# Altium schematic sheet BARTGL.SchDoc
size A3; SheetNumber: 22; SheetTotal: 22
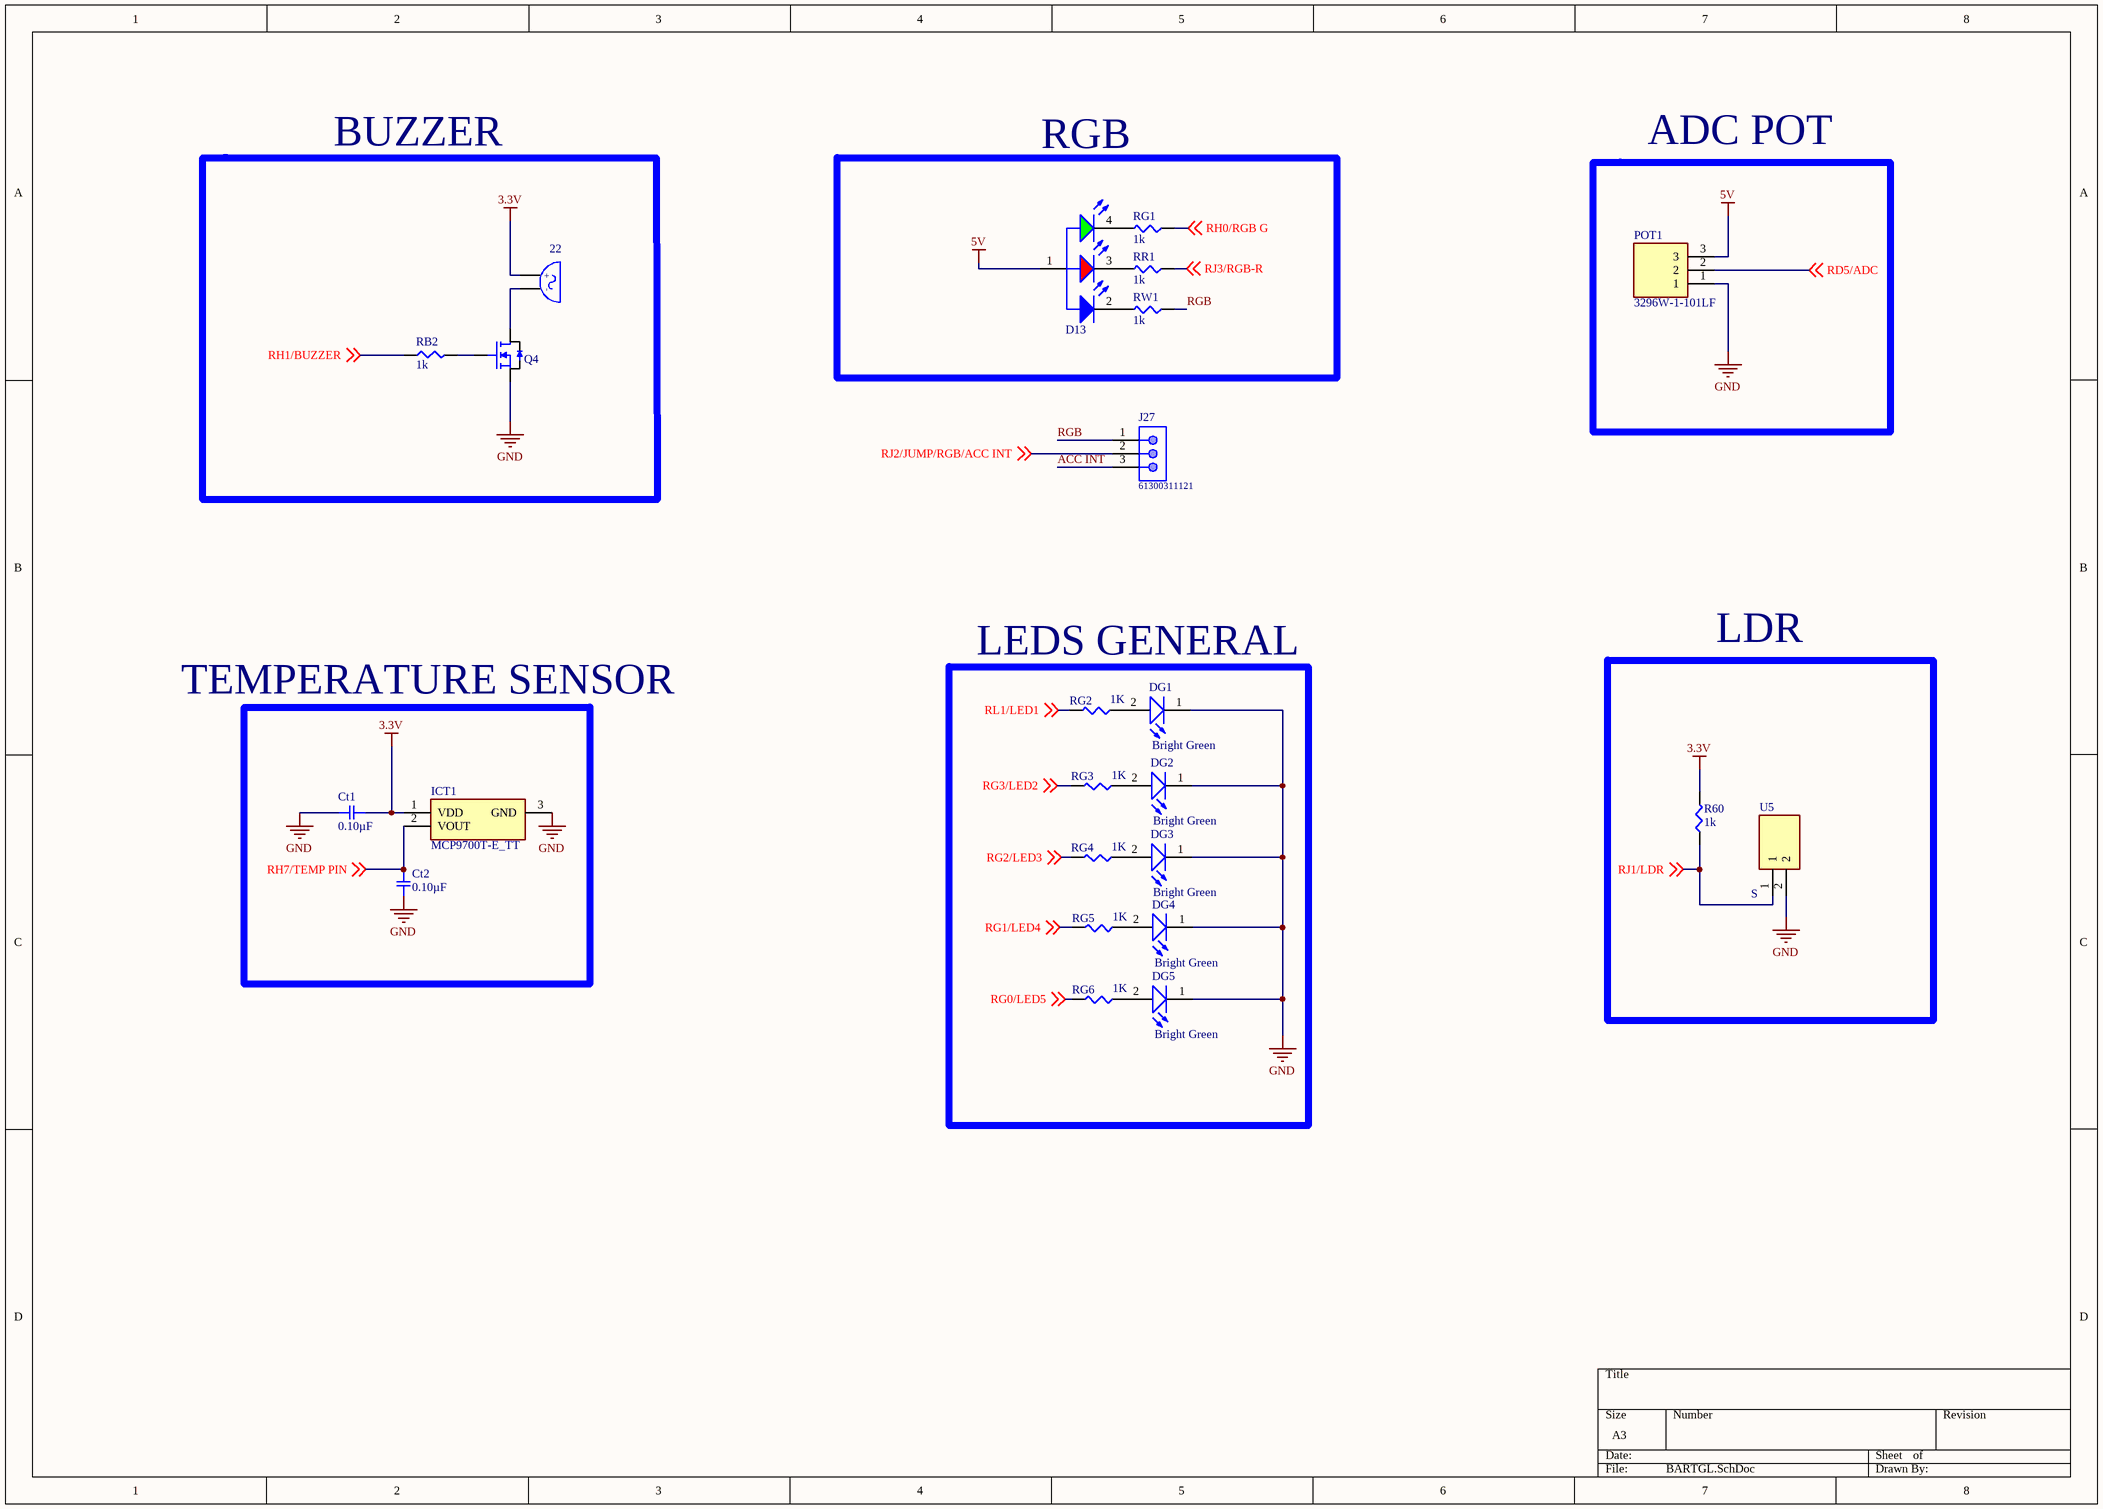
[diagram p0: BARTGL.SchDoc]

## Parts
22  WST-1205S  [Buzzer 5v]  (value not drawn)
Ct1  0.10µF  [SMD-0805C]
Ct2  0.10µF  [SMD-0805C]
D13  Red & Green & Blue, 120°  [WL-SFTW_3528_150141M173100]  (value not drawn)
DG1  Emitting Color: Bright Green  [WL-SMCW_0805]  (hidden comment: 150080VS75000)
DG2  Emitting Color: Bright Green  [WL-SMCW_0805]  (hidden comment: 150080VS75000)
DG3  Emitting Color: Bright Green  [WL-SMCW_0805]  (hidden comment: 150080VS75000)
DG4  Emitting Color: Bright Green  [WL-SMCW_0805]  (hidden comment: 150080VS75000)
DG5  Emitting Color: Bright Green  [WL-SMCW_0805]  (hidden comment: 150080VS75000)
ICT1  MCP9700T-E_TT  [SOT95P237X112-3N]
J27  61300311121  [61300311121]
POT1  3296W-1-101LF  [3296W-1]
Q4  S12302DS Nchanel SMD SOT-23  [SOT-23-3N]  (value not drawn)
R60  1k  [SMD-0805-RES]
RB2  1k  [SMD-0805-RES]
RG1  1k  [SMD-0805-RES]
RG2  1K  [SMD-0805-RES]
RG3  1K  [SMD-0805-RES]
RG4  1K  [SMD-0805-RES]
RG5  1K  [SMD-0805-RES]
RG6  1K  [SMD-0805-RES]
RR1  1k  [SMD-0805-RES]
RW1  1k  [SMD-0805-RES]
U5  S  [NSL-19M51]

## Blocks framed on the sheet
BUZZER: 22 Q4 RB2
RGB: D13 RG1 RR1 RW1
ADC POT: POT1
LEDS GENERAL: DG1-DG5 RG2-RG6
LDR: R60 U5

## Nets
3.3V: 22.1 Ct1.1 ICT1.1(VDD) R60.2
5V: D13.1(A) POT1.3
GND: Ct1.2 Ct2.2 DG1.1(K) DG2.1(K) DG3.1(K) DG4.1(K) DG5.1(K) ICT1.3(GND) POT1.1 Q4.2(Source) U5.2
ACC INT: J27.3
RD5/ADC: POT1.2 ; off-sheet RD5/ADC
RG0/LED5: RG6.2 ; off-sheet RG0/LED5
RG1/LED4: RG5.2 ; off-sheet RG1/LED4
RG2/LED3: RG4.2 ; off-sheet RG2/LED3
RG3/LED2: RG3.2 ; off-sheet RG3/LED2
RGB: J27.1 RW1.1
RH0/RGB G: RG1.1 ; off-sheet RH0/RGB G
RH1/BUZZER: RB2.1 ; off-sheet RH1/BUZZER
RH7/TEMP PIN: Ct2.1 ICT1.2(VOUT) ; off-sheet RH7/TEMP PIN
RJ1/LDR: R60.1 U5.1 ; off-sheet RJ1/LDR
RJ2/JUMP/RGB/ACC INT: J27.2 ; off-sheet RJ2/JUMP/RGB/ACC INT
RJ3/RGB-R: RR1.1 ; off-sheet RJ3/RGB-R
RL1/LED1: RG2.2 ; off-sheet RL1/LED1
Net22_2: 22.2 Q4.3(Drain)
NetD13_2: D13.2(K) RW1.2
NetD13_3: D13.3(K) RR1.2
NetD13_4: D13.4(K) RG1.2
NetDG1_2: DG1.2(A) RG2.1
NetDG2_2: DG2.2(A) RG3.1
NetDG3_2: DG3.2(A) RG4.1
NetDG4_2: DG4.2(A) RG5.1
NetDG5_2: DG5.2(A) RG6.1
NetQ4_1: Q4.1(Gate) RB2.2

## Notes on the sheet
- TEMPERATURE SENSOR
- (in symbol Buzzer) +; -

## Library data of the parts
22 = Buzzer: Buzzer 2.3khz 4-6vdc Pcb Wash; MF: Soberton Inc.; Package: Soberton Inc.; MP: WST-1205S; Price: None; Availability: Unavailable; SnapEDA_Link: https://www.snapeda.com/parts/WST-1205S/Soberton%20Inc./view-part/?ref=snap; Value: *
Ct1 Ct2 = GCD21BR71H104KA01L: CAP CER 0.1UF 50V X7R 0805; Manufacturer: Murata Electronics North America; Factory Stock: 0; Unit Price (USD): 0.24; Minimum Quantity: 1; Tolerance: ±10%; Datasheets: http://www.murata.com/~/media/webrenewal/support/library/catalog/products/capacitor/mlcc/c03e.ashx; Image: //media.digikey.com/Renders/Murata%20Renders/0805%28GxM6%29.jpg; Digi-Key Part Number: 490-11955-1-ND; Part Number: GCD21BR71H104KA01L; Quantity Available: 157; @ qty: 0; Packaging: Cut Tape (CT); Series: GCD; Part Status: Active; Value: 0.10µF; Voltage: 50V; Temperature Coefficient: X7R; Operating Temperature: -55°C ~ 125°C; Features: -; Ratings: AEC-Q200; Applications: Automotive; Mounting Type: Surface Mount, MLCC; Package / Case: 0805 (2012 Metric); Size / Dimension: 0.079" L x 0.049" W (2.00mm x 1.25mm); Height - Seated (Max): -; Thickness (Max): 0.049" (1.25mm); Lead Spacing: -; Lead Style: -
D13 = 150141M173100: WL-SFTW Full-color TOP LED Waterclear, size 3528, Red & Green & Blue, 120°; Manufacturer: Wurth Elektronik; Case/Size Code: 3528; Chip Technology: AlInGaP + InGaN; Dominant Wavelength (Blue): 470nm; Dominant Wavelength (Green): 520nm; Dominant Wavelength (Red): 625nm; Forward Voltage (Blue): 3.2V; Forward Voltage (Red): 2V; Luminous Intensity (Blue): 230mcd; Luminous Intensity (Green): 950mcd; Luminous Intensity (Red): 270mcd; Peak Wavelength (Blue): 465nm; Peak Wavelength (Green): 515nm; Peak Wavelength (Red): 635nm; Manufacturer Part Number: 150141M173100; Category: Signal LEDs; Match Code: WL-SFTW; ComponentLink1Description: Website Link; ComponentLink1URL: https://www.we-online.com/redexpert/article/150141M173100?ad; ComponentLink2Description: Datasheet Link; ComponentLink2URL: https://www.we-online.com/redexpert/spec/150141M173100?ad; Mount: Surface Mount; Operating Temperature Max: 85°C; Operating Temperature Min: -40°C; Packaging: Tape and Reel; Length: 3.5mm; Width: 2.8mm; Height: 1.9mm; Emitting Color: Red & Green & Blue; Forward Voltage (Green): 3.2V; Viewing Angle: 120°
DG1-DG5 = 150080VS75000: WL-SMCW SMD Mono-color Chip LED Waterclear, size 0805, Bright Green; Forward Voltage: 2 V; Viewing Angle: 140°; Peak Wavelength: 572 nm; Published Date: Jan 2017; Publisher: Wurth Elektronik; ComponentLink1Description: Manufacturer; ComponentLink1URL: http://www.we-online.de; ComponentLink2Description: Datasheet; ComponentLink2URL: http://katalog.we-online.de/led/datasheet/150080VS75000.pdf; Part Number: 150080VS75000; Size: 0805
ICT1 = MCP9700T-E_TT: Integrated Circuit; Manufacturer_Name: Microchip; Manufacturer_Part_Number: MCP9700T-E/TT; Datasheet Link: https://datasheet.datasheetarchive.com/originals/distributors/Datasheets-DGA2/179941.pdf; Height: 1.12mm; Mouser Part Number: 579-MCP9700T-E/TT; Mouser Price/Stock: https://www.mouser.co.uk/ProductDetail/Microchip-Technology/MCP9700T-E-TT?qs=QVBMgXxBiLyzQ04uBGj3mg%3D%3D; Arrow Part Number: MCP9700T-E/TT; Arrow Price/Stock: https://www.arrow.com/en/products/mcp9700t-ett/microchip-technology?region=nac
J27 = 61300311121: WR-PHD Pin Header, THT, pitch 2.54mm, Single Row, Vertical, 3pin; Pin Number: 3; Gender: Male; Rated Current: 3A; Working Voltage: 250VAC; Withstanding Voltage: 500VAC; Contact Resistance: 20mOhm; ComponentLink1Description: Manufacturer; ComponentLink1URL: http://www.we-online.de; ComponentLink2Description: Datasheet; ComponentLink2URL: https://katalog.we-online.de/em/datasheet/6130xx11121.pdf; Part Number: 61300311121; Published Date: June 2019; Publisher: Wurth Elektronik; Pitch: 2.54mm; Operating Temperature: -40 to +105degC; Mounting Technology: THT; Packaging: Bag; Row Number: Single; Orientation: Vertical
POT1 = 3296W-1-101LF: Resistor; Manufacturer_Name: Bourns; Datasheet Link: https://www.bourns.com/pdfs/3296.pdf; Manufacturer_Part_Number: 3296W-1-101LF; Mouser Part Number: 652-3296W-1-101LF; Mouser Price/Stock: https://www.mouser.co.uk/ProductDetail/Bourns/3296W-1-101LF?qs=UcU9LKO1dwEefwKxVJG4Jw%3D%3D; Arrow Part Number: 3296W-1-101LF; Arrow Price/Stock: https://www.arrow.com/en/products/3296w-1-101lf/bourns?region=nac
Q4 = S12302DS: S12302DS Nchanel SMD SOT-23. VDS MAX 20. 400Ma DI
R60 RB2 RG1-RG6 RR1 RW1 = ERJ-6ENF1001V: RES SMD 1K OHM 1% 1/8W 0805; Manufacturer: Panasonic Electronic Components; Factory Stock: 0; Unit Price (USD): 0.00729; @ qty: 1500; Minimum Quantity: 1; Power (Watts): 0.125W, 1/8W; Temperature Coefficient: ±100ppm/°C; Part Number: ERJ-6ENF1001V; Datasheets: http://industrial.panasonic.com/www-cgi/jvcr13pz.cgi?E+PZ+3+AOA0002+ERJ6ENF1001V+7+WW; Image: //media.digikey.com/Renders/Panasonic%20Renders/ERJ-0805%20Pkg.jpg; Digi-Key Part Number: P1.00KCCT-ND; Quantity Available: 12895103; Packaging: Cut Tape (CT); Series: ERJ; Part Status: Active; Value: 1k; Tolerance: ±1%; Composition: Thick Film; Features: Automotive AEC-Q200; Operating Temperature: -55°C ~ 155°C; Package / Case: 0805 (2012 Metric); Supplier Device Package: 0805; Size / Dimension: 0.079" L x 0.049" W (2.00mm x 1.25mm); Height - Seated (Max): 0.028" (0.70mm); Number of Terminations: 2; Failure Rate: -
U5 = NSL-19M51: Undefined or Miscellaneous; Manufacturer_Name: Silonex; Datasheet Link: http://uk.rs-online.com/web/p/products/9146710; Manufacturer_Part_Number: NSL-19M51